# EAGLE design LEDscape (EAGLE 6.5.0)
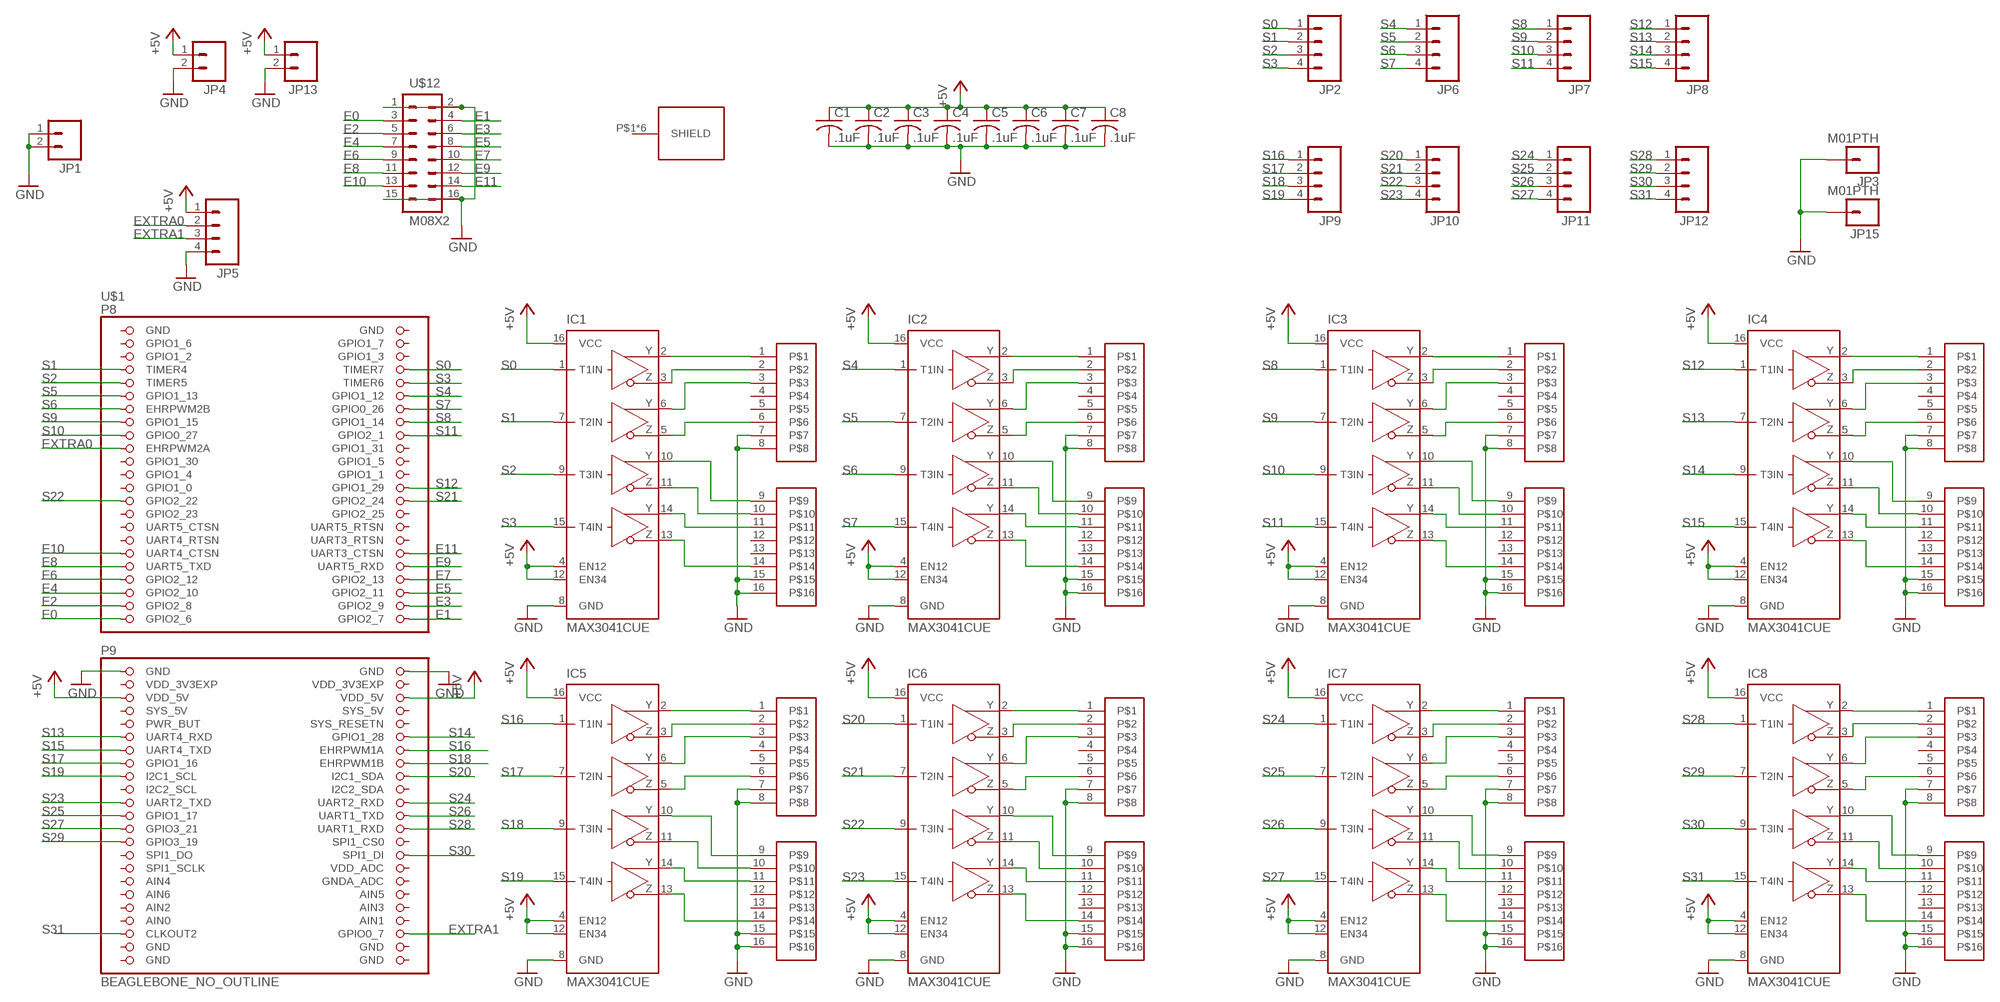
[diagram p0: schematic, sheet 1]

## Parts
C1  .1uF  C-USC0603  [C0603]
C2  .1uF  C-USC0603  [C0603]
C3  .1uF  C-USC0603  [C0603]
C4  .1uF  C-USC0603  [C0603]
C5  .1uF  C-USC0603  [C0603]
C6  .1uF  C-USC0603  [C0603]
C7  .1uF  C-USC0603  [C0603]
C8  .1uF  C-USC0603  [C0603]
IC1  MAX3041CUE  [TSSOP16]
IC2  MAX3041CUE  [TSSOP16]
IC3  MAX3041CUE  [TSSOP16]
IC4  MAX3041CUE  [TSSOP16]
IC5  MAX3041CUE  [TSSOP16]
IC6  MAX3041CUE  [TSSOP16]
IC7  MAX3041CUE  [TSSOP16]
IC8  MAX3041CUE  [TSSOP16]
JP1  M025MM  [SCREWTERMINAL-5MM-2]
JP2  M041X04_NO_SILK  [1X04_NO_SILK]
JP3  M01PTH  [1X01]
JP4  M025MM  [SCREWTERMINAL-5MM-2]
JP5  M041X04_NO_SILK  [1X04_NO_SILK]
JP6  M041X04_NO_SILK  [1X04_NO_SILK]
JP7  M041X04_NO_SILK  [1X04_NO_SILK]
JP8  M041X04_NO_SILK  [1X04_NO_SILK]
JP9  M041X04_NO_SILK  [1X04_NO_SILK]
JP10  M041X04_NO_SILK  [1X04_NO_SILK]
JP11  M041X04_NO_SILK  [1X04_NO_SILK]
JP12  M041X04_NO_SILK  [1X04_NO_SILK]
JP13  M025MM  [SCREWTERMINAL-5MM-2]
JP15  M01PTH  [1X01]
U$1  BEAGLEBONE_NO_OUTLINE  [BEAGLEBONE_SHIELD_NO_OUTLINE]
U$2  RJ45_8X2_BASE  [RJ45_8X2_BASE]
U$3  RJ45_8X2_JACK  [RJ45_8X2_JACK]
U$4  RJ45_8X2_JACK  [RJ45_8X2_JACK]
U$5  RJ45_8X2_JACK  [RJ45_8X2_JACK]
U$6  RJ45_8X2_JACK  [RJ45_8X2_JACK]
U$7  RJ45_8X2_JACK  [RJ45_8X2_JACK]
U$8  RJ45_8X2_JACK  [RJ45_8X2_JACK]
U$9  RJ45_8X2_JACK  [RJ45_8X2_JACK]
U$10  RJ45_8X2_JACK  [RJ45_8X2_JACK]
U$12  M08X2  [2X8]

## Nets
+5V: C1.1 C2.1 C3.1 C4.1 C5.1 C6.1 C7.1 C8.1 IC1.4(EN12) IC1.12(EN34) IC1.16(VCC) IC2.4(EN12) IC2.12(EN34) IC2.16(VCC) IC3.4(EN12) IC3.12(EN34) IC3.16(VCC) IC4.4(EN12) IC4.12(EN34) IC4.16(VCC) IC5.4(EN12) IC5.12(EN34) IC5.16(VCC) IC6.4(EN12) IC6.12(EN34) IC6.16(VCC) IC7.4(EN12) IC7.12(EN34) IC7.16(VCC) IC8.4(EN12) IC8.12(EN34) IC8.16(VCC) JP4.1 JP5.1 JP13.1 U$1.51(VDD_5V) U$1.52(VDD_5V)
E0: U$1.45(GPIO2_6) U$12.3
E1: U$1.46(GPIO2_7) U$12.4
E2: U$1.43(GPIO2_8) U$12.5
E3: U$1.44(GPIO2_9) U$12.6
E4: U$1.41(GPIO2_10) U$12.7
E5: U$1.42(GPIO2_11) U$12.8
E6: U$1.39(GPIO2_12) U$12.9
E7: U$1.40(GPIO2_13) U$12.10
E8: U$1.37(UART5_TXD) U$12.11
E9: U$1.38(UART5_RXD) U$12.12
E10: U$1.35(UART4_CTSN) U$12.13
E11: U$1.36(UART3_CTSN) U$12.14
EXTRA0: JP5.2 U$1.19(EHRPWM2A)
EXTRA1: JP5.3 U$1.88(GPIO0_7)
GND: C1.2 C2.2 C3.2 C4.2 C5.2 C6.2 C7.2 C8.2 IC1.8(GND) IC2.8(GND) IC3.8(GND) IC4.8(GND) IC5.8(GND) IC6.8(GND) IC7.8(GND) IC8.8(GND) JP1.1 JP1.2 JP3.1 JP4.2 JP5.4 JP13.2 JP15.1 U$1.47(GND) U$1.48(GND) U$3.7 U$3.8 U$3.15 U$3.16 U$4.7 U$4.8 U$4.15 U$4.16 U$5.7 U$5.8 U$5.15 U$5.16 U$6.7 U$6.8 U$6.15 U$6.16 U$7.7 U$7.8 U$7.15 U$7.16 U$8.7 U$8.8 U$8.15 U$8.16 U$9.7 U$9.8 U$9.15 U$9.16 U$10.7 U$10.8 U$10.15 U$10.16 U$12.1 U$12.2 U$12.15 U$12.16
N$1: IC1.2(Y1) U$3.1
N$2: IC1.3(Z1) U$3.2
N$3: IC2.2(Y1) U$4.1
N$4: IC1.6(Y2) U$3.3
N$5: IC1.5(Z2) U$3.6
N$6: IC1.10(Y3) U$3.9
N$7: IC1.11(Z3) U$3.10
N$8: IC1.14(Y4) U$3.11
N$9: IC1.13(Z4) U$3.14
N$10: IC2.3(Z1) U$4.2
N$11: IC6.5(Z2) U$7.6
N$12: IC2.6(Y2) U$4.3
N$13: IC2.5(Z2) U$4.6
N$14: IC3.5(Z2) U$5.6
N$15: IC2.10(Y3) U$4.9
N$16: IC2.11(Z3) U$4.10
N$17: IC2.14(Y4) U$4.11
N$18: IC2.13(Z4) U$4.14
N$19: IC3.2(Y1) U$5.1
N$20: IC3.3(Z1) U$5.2
N$21: IC3.6(Y2) U$5.3
N$22: IC3.13(Z4) U$5.14
N$23: IC3.10(Y3) U$5.9
N$24: IC3.11(Z3) U$5.10
N$25: IC3.14(Y4) U$5.11
N$26: IC7.6(Y2) U$8.3
N$27: IC4.2(Y1) U$9.1
N$28: IC4.3(Z1) U$9.2
N$29: IC4.6(Y2) U$9.3
N$30: IC4.5(Z2) U$9.6
N$31: IC4.13(Z4) U$9.14
N$32: IC4.11(Z3) U$9.10
N$33: IC4.14(Y4) U$9.11
N$34: IC4.10(Y3) U$9.9
N$35: IC5.2(Y1) U$6.1
N$36: IC5.3(Z1) U$6.2
N$37: IC5.6(Y2) U$6.3
N$38: IC5.5(Z2) U$6.6
N$39: IC5.10(Y3) U$6.9
N$40: IC5.11(Z3) U$6.10
N$41: IC5.14(Y4) U$6.11
N$42: IC5.13(Z4) U$6.14
N$43: IC6.2(Y1) U$7.1
N$44: IC6.3(Z1) U$7.2
N$45: IC6.6(Y2) U$7.3
N$46: IC7.5(Z2) U$8.6
N$47: IC6.10(Y3) U$7.9
N$48: IC6.11(Z3) U$7.10
N$49: IC6.14(Y4) U$7.11
N$50: IC6.13(Z4) U$7.14
N$51: IC7.2(Y1) U$8.1
N$52: IC7.3(Z1) U$8.2
N$53: IC7.10(Y3) U$8.9
N$54: IC7.14(Y4) U$8.11
N$55: IC7.13(Z4) U$8.14
N$56: IC7.11(Z3) U$8.10
N$58: IC8.6(Y2) U$10.3
N$59: IC8.2(Y1) U$10.1
N$60: IC8.3(Z1) U$10.2
N$61: IC8.5(Z2) U$10.6
N$62: IC8.14(Y4) U$10.11
N$63: IC8.10(Y3) U$10.9
N$64: IC8.11(Z3) U$10.10
N$65: IC8.13(Z4) U$10.14
S0: IC1.1(T1IN) JP2.1 U$1.8(TIMER7)
S1: IC1.7(T2IN) JP2.2 U$1.7(TIMER4)
S2: IC1.9(T3IN) JP2.3 U$1.9(TIMER5)
S3: IC1.15(T4IN) JP2.4 U$1.10(TIMER6)
S4: IC2.1(T1IN) JP6.1 U$1.12(GPIO1_12)
S5: IC2.7(T2IN) JP6.2 U$1.11(GPIO1_13)
S6: IC2.9(T3IN) JP6.3 U$1.13(EHRPWM2B)
S7: IC2.15(T4IN) JP6.4 U$1.14(GPIO0_26)
S8: IC3.1(T1IN) JP7.1 U$1.16(GPIO1_14)
S9: IC3.7(T2IN) JP7.2 U$1.15(GPIO1_15)
S10: IC3.9(T3IN) JP7.3 U$1.17(GPIO0_27)
S11: IC3.15(T4IN) JP7.4 U$1.18(GPIO2_1)
S12: IC4.1(T1IN) JP8.1 U$1.26(GPIO1_29)
S13: IC4.7(T2IN) JP8.2 U$1.57(UART4_RXD)
S14: IC4.9(T3IN) JP8.3 U$1.58(GPIO1_28)
S15: IC4.15(T4IN) JP8.4 U$1.59(UART4_TXD)
S16: IC5.1(T1IN) JP9.1 U$1.60(EHRPWM1A)
S17: IC5.7(T2IN) JP9.2 U$1.61(GPIO1_16)
S18: IC5.9(T3IN) JP9.3 U$1.62(EHRPWM1B)
S19: IC5.15(T4IN) JP9.4 U$1.63(I2C1_SCL)
S20: IC6.1(T1IN) JP10.1 U$1.64(I2C1_SDA)
S21: IC6.7(T2IN) JP10.2 U$1.28(GPIO2_24)
S22: IC6.9(T3IN) JP10.3 U$1.27(GPIO2_22)
S23: IC6.15(T4IN) JP10.4 U$1.67(UART2_TXD)
S24: IC7.1(T1IN) JP11.1 U$1.68(UART2_RXD)
S25: IC7.7(T2IN) JP11.2 U$1.69(GPIO1_17)
S26: IC7.9(T3IN) JP11.3 U$1.70(UART1_TXD)
S27: IC7.15(T4IN) JP11.4 U$1.71(GPIO3_21)
S28: IC8.1(T1IN) JP12.1 U$1.72(UART1_RXD)
S29: IC8.7(T2IN) JP12.2 U$1.73(GPIO3_19)
S30: IC8.9(T3IN) JP12.3 U$1.76(SPI1_DI)
S31: IC8.15(T4IN) JP12.4 U$1.87(CLKOUT2)
Unconnected: U$1.3(GPIO1_6) U$1.4(GPIO1_7) U$1.5(GPIO1_2) U$1.6(GPIO1_3) U$1.20(GPIO1_31) U$1.21(GPIO1_30) U$1.22(GPIO1_5) U$1.23(GPIO1_4) U$1.24(GPIO1_1) U$1.25(GPIO1_0) U$1.29(GPIO2_23) U$1.30(GPIO2_25) U$1.31(UART5_CTSN) U$1.32(UART5_RTSN) U$1.33(UART4_RTSN) U$1.34(UART3_RTSN) U$1.54(SYS_5V) U$1.55(PWR_BUT) U$1.56(SYS_RESETN) U$1.65(I2C2_SCL) U$1.66(I2C2_SDA) U$1.74(SPI1_CS0) U$1.75(SPI1_DO) U$1.77(SPI1_SCLK) U$1.78(VDD_ADC) U$1.79(AIN4) U$1.80(GNDA_ADC) U$1.81(AIN6) U$1.82(AIN5) U$1.83(AIN2) U$1.84(AIN3) U$1.86(AIN1) U$2.P$1(SHIELD) U$2.P$2(SHIELD) U$2.P$3(SHIELD) U$2.P$4(SHIELD) U$2.P$5(SHIELD) U$2.P$6(SHIELD) U$3.4 U$3.5 U$3.12 U$3.13 U$4.4 U$4.5 U$4.12 U$4.13 U$5.4 U$5.5 U$5.12 U$5.13 U$6.4 U$6.5 U$6.12 U$6.13 U$7.4 U$7.5 U$7.12 U$7.13 U$8.4 U$8.5 U$8.12 U$8.13 U$9.4 U$9.5 U$9.12 U$9.13 U$10.4 U$10.5 U$10.12 U$10.13

## Power pins joined to a net without a drawn wire
AIN0: U$1.85(AIN0)
GND: U$1.1(GND) U$1.2(GND) U$1.89(GND) U$1.90(GND) U$1.91(GND) U$1.92(GND)
SYS_5V: U$1.53(SYS_5V)
VDD_3V3EXP: U$1.49(VDD_3V3EXP) U$1.50(VDD_3V3EXP)

## Library data of the parts
C1-C8 = adafruit:C-US: CAPACITOR, American symbol
IC1-IC8 = maxim:MAX30*: ±10kV ESD-Protected, Quad 5V RS-485/RS-422 Transmitters Source: www.maxim-ic.com .. MAX3040-MAX3045.pdf; MPN: MAX3041CUE+; OC_FARNELL: unknown; OC_NEWARK: 73K8525
JP1 JP4 JP13 = SparkFun-Connectors:M02: Header 2 Standard 2-pin 0.1" header. Use with straight break away headers (SKU : PRT-00116), right angle break away headers (PRT-00553), swiss pins (PRT-00743), machine pins (PRT-00117), and female headers (PRT-00115). Molex polarized connector foot print use with SKU : PRT-08233 with associated crimp pins and housings.
JP2 JP5-JP12 = SparkFun-Connectors:M04: Header 4 Standard 4-pin 0.1" header. Use with straight break away headers (SKU : PRT-00116), right angle break away headers (PRT-00553), swiss pins (PRT-00743), machine pins (PRT-00117), and female headers (PRT-00115). Molex polarized connector foot print use with SKU : PRT-08231 with associated crimp pins and housings. 1MM SMD Version SKU: PRT-10208
JP3 JP15 = SparkFun-Connectors:M01: Header 1 Standard 1-pin 0.1" header. Use with straight break away headers (SKU : PRT-00116), right angle break away headers (PRT-00553), swiss pins (PRT-00743), machine pins (PRT-00117), and female headers (PRT-00115).
U$1 = LEDscape:BEAGLEBONE_NO_OUTLINE: Should match A3 pinout - but not completely tested
U$2 = LEDscape:RJ45_8X2_BASE
U$3-U$10 = LEDscape:RJ45_8X2_JACK
U$12 = SparkFun-Connectors:M08X2: .1" headers, two rows of 8 each

## Board
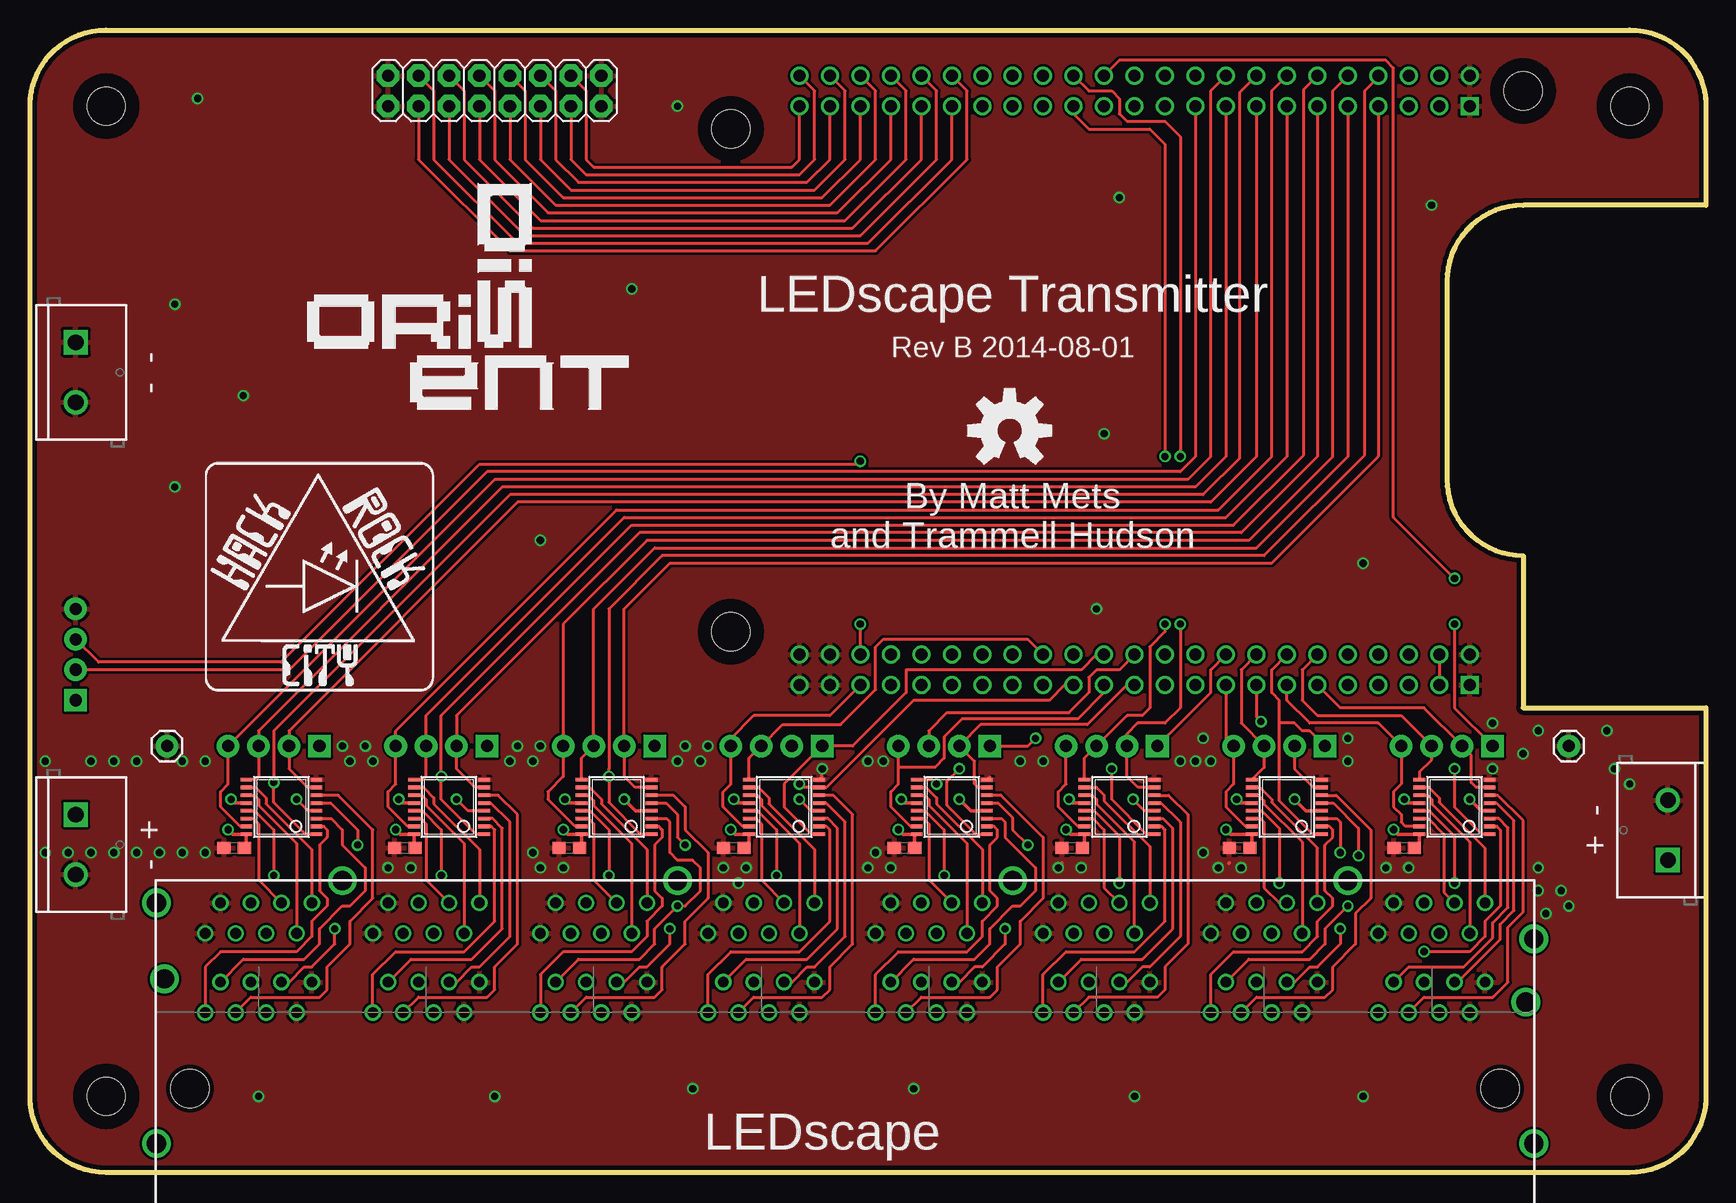
[diagram p1: board, top side]
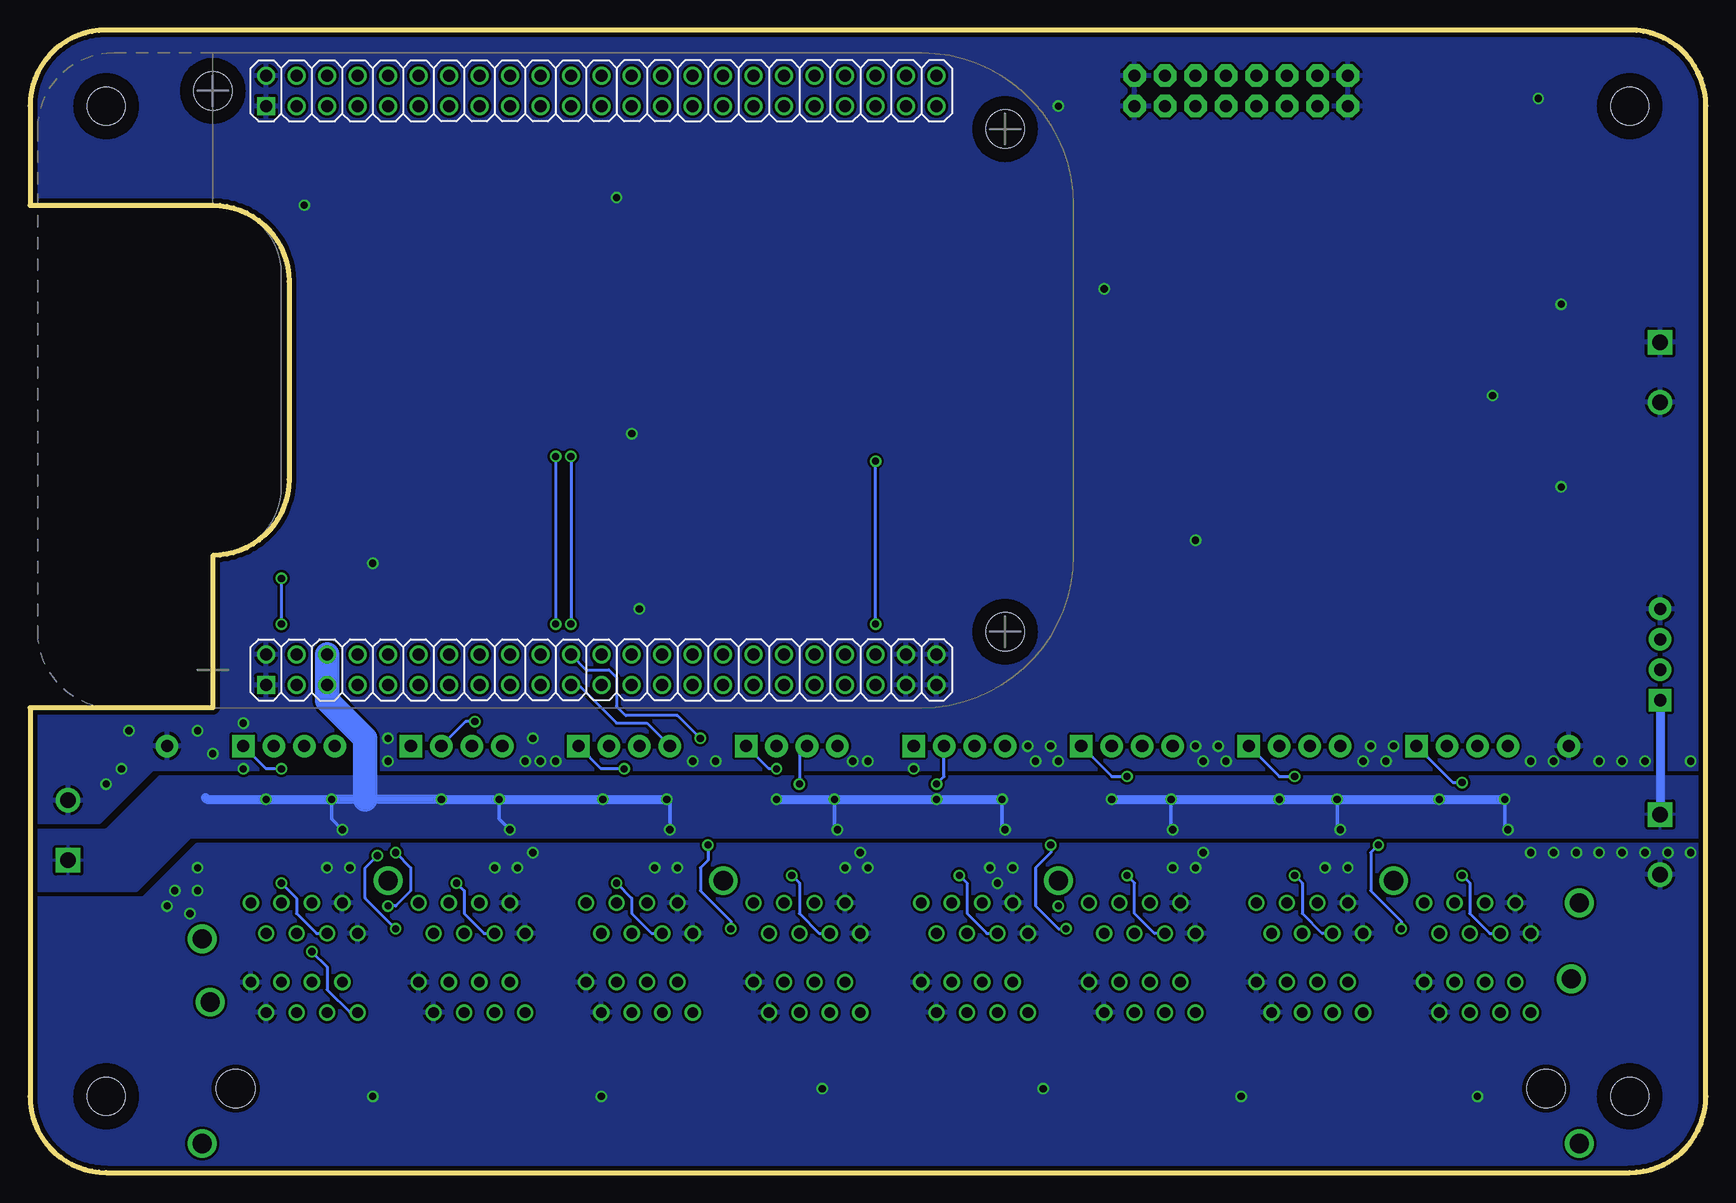
[diagram p2: board, bottom side, seen from below]

Size 139.7 x 95.25 mm. Coordinates in mm from the lower left corner, seen from the top.
Outline: 139.7,38.73 139.7,6.35 arc-90 133.35,0 6.35,0 arc-90 0,6.35 0,88.9 arc-90 6.35,95.25 133.35,95.25 arc-90 139.7,88.9 139.7,80.64 124.46,80.64 arc90 118.11,74.3 118.11,57.78 arc90 124.46,51.44 124.46,38.73 139.7,38.73
Copper layers (1+16): Top 0.0356mm / dielectric 1.5011mm / Bottom 0.0356mm
Design rules "LaenPCBOrder *": minimum track width 10mil, minimum drill 13mil, track to track 8mil, track to pad 8mil, pad to pad 8mil, via to via 8mil, smd to smd 6mil, copper to edge 15mil, drill to drill 6mil, minimum pad ring 7mil, minimum via ring 7mil, stop-mask expansion 4mil, vias tented up to drill 2mm, thermal gap 10mil
Holes 3.17 mm at 133.35,6.35 6.35,6.35 133.35,88.9 6.35,88.9 124.46,90.17 58.42,45.09 58.42,87
tRestrict: area 130.8,3.8 to 135.9,8.9; area 3.8,3.8 to 8.9,8.9; area 130.8,86.4 to 135.9,91.4; area 3.8,86.4 to 8.9,91.4; area 121.9,87.6 to 127,92.7; area 55.9,42.5 to 61,47.6; area 55.9,84.5 to 61,89.5
bRestrict: area 130.8,3.8 to 135.9,8.9; area 3.8,3.8 to 8.9,8.9; area 130.8,86.4 to 135.9,91.4; area 3.8,86.4 to 8.9,91.4; area 121.9,87.6 to 127,92.7; area 55.9,42.5 to 61,47.6; area 55.9,84.5 to 61,89.5

### Footprints (pad centres in the part's own frame; a part is rotated, then mirrored left to right if it is on the bottom)
C0603 = smd 1.1 x 1: 1 -0.85,0; 2 0.85,0
TSSOP16 = smd 0.305 x 0.991: 1 -2.275,-2.918; 2 -1.625,-2.918; 3 -0.975,-2.918; 4 -0.325,-2.918; 5 0.325,-2.918; 6 0.975,-2.918; 7 1.625,-2.918; 8 2.275,-2.918; 9 2.275,2.918; 10 1.625,2.918; 11 0.975,2.918; 12 0.325,2.918; 13 -0.325,2.918; 14 -0.975,2.918; 15 -1.625,2.918; 16 -2.275,2.918
SCREWTERMINAL-5MM-2 = drill 1.3 pad 2.032 square: 1 0,0 | drill 1.3 pad 2.032: 2 5,0
1X04_NO_SILK = drill 1.016 pad 1.88 square: 1 0,0 | drill 1.016 pad 1.88: 2 2.54,0; 3 5.08,0; 4 7.62,0
1X01 = drill 1.016 pad 1.88: 1 0,0
BEAGLEBONE_SHIELD_NO_OUTLINE = drill 1 square: 1 4.445,19.05; 47 52.705,19.05 | drill 1: 2 1.905,19.05; 3 4.445,21.59; 4 1.905,21.59; 5 4.445,24.13; 6 1.905,24.13; 7 4.445,26.67; 8 1.905,26.67; 9 4.445,29.21; 10 1.905,29.21; 11 4.445,31.75; 12 1.905,31.75; 13 4.445,34.29; 14 1.905,34.29; 15 4.445,36.83; 16 1.905,36.83; 17 4.445,39.37; 18 1.905,39.37; 19 4.445,41.91; 20 1.905,41.91; 21 4.445,44.45; 22 1.905,44.45; 23 4.445,46.99; 24 1.905,46.99; 25 4.445,49.53; 26 1.905,49.53; 27 4.445,52.07; 28 1.905,52.07; 29 4.445,54.61; 30 1.905,54.61; 31 4.445,57.15; 32 1.905,57.15; 33 4.445,59.69; 34 1.905,59.69; 35 4.445,62.23; 36 1.905,62.23; 37 4.445,64.77; 38 1.905,64.77; 39 4.445,67.31; 40 1.905,67.31; 41 4.445,69.85; 42 1.905,69.85; 43 4.445,72.39; 44 1.905,72.39; 45 4.445,74.93; 46 1.905,74.93; 48 50.165,19.05; 49 52.705,21.59; 50 50.165,21.59; 51 52.705,24.13; 52 50.165,24.13; 53 52.705,26.67; 54 50.165,26.67; 55 52.705,29.21; 56 50.165,29.21; 57 52.705,31.75; 58 50.165,31.75; 59 52.705,34.29; 60 50.165,34.29; 61 52.705,36.83; 62 50.165,36.83; 63 52.705,39.37; 64 50.165,39.37; 65 52.705,41.91; 66 50.165,41.91; 67 52.705,44.45; 68 50.165,44.45; 69 52.705,46.99; 70 50.165,46.99; 71 52.705,49.53; 72 50.165,49.53; 73 52.705,52.07; 74 50.165,52.07; 75 52.705,54.61; 76 50.165,54.61; 77 52.705,57.15; 78 50.165,57.15; 79 52.705,59.69; 80 50.165,59.69; 81 52.705,62.23; 82 50.165,62.23; 83 52.705,64.77; 84 50.165,64.77; 85 52.705,67.31; 86 50.165,67.31; 87 52.705,69.85; 88 50.165,69.85; 89 52.705,72.39; 90 50.165,72.39; 91 52.705,74.93; 92 50.165,74.93
RJ45_8X2_BASE = drill 1.6: P$1 -57.4,15.5; P$2 -56.73,9.15; P$3 -57.4,-4.57; P$4 57.4,12.5; P$5 56.73,7.22; P$6 57.4,-4.57; P$7 13.97,17.35; P$8 41.91,17.35; P$9 -41.91,17.35; P$10 -13.97,17.35 | hole 3.2: -54.61,0; 54.61,0
RJ45_8X2_JACK = drill 0.9: 1 -4.445,0; 2 -3.175,2.54; 3 -1.905,0; 4 -0.635,2.54; 5 0.635,0; 6 1.905,2.54; 7 3.175,0; 8 4.445,2.54; 9 4.445,9.14; 10 3.175,6.6; 11 1.905,9.14; 12 0.635,6.6; 13 -0.635,9.14; 14 -1.905,6.6; 15 -3.175,9.14; 16 -4.445,6.6
2X8 = drill 1.016 pad 1.88 octagon: 1 0,0; 2 0,2.54; 3 2.54,0; 4 2.54,2.54; 5 5.08,0; 6 5.08,2.54; 7 7.62,0; 8 7.62,2.54; 9 10.16,0; 10 10.16,2.54; 11 12.7,0; 12 12.7,2.54; 13 15.24,0; 14 15.24,2.54; 15 17.78,0; 16 17.78,2.54

### Placement (x,y rotation side)
C1  17.02,27.05 180 top
C2  31.24,27.05 180 top
C3  44.96,27.05 180 top
C4  58.67,27.05 180 top
C5  72.9,27.05 180 top
C6  86.87,27.05 180 top
C7  100.84,27.05 180 top
C8  114.55,27.05 180 top
IC1  48.9,30.48 90 top
IC2  34.92,30.48 90 top
IC3  20.95,30.48 90 top
IC4  118.75,30.48 90 top
IC5  104.78,30.48 90 top
IC6  90.81,30.48 90 top
IC7  76.83,30.48 90 top
IC8  62.87,30.48 90 top
JP1  3.81,69.22 270 top
JP2  52.07,35.56 180 top
JP3  11.43,35.56 0 top
JP4  3.81,29.84 270 top
JP5  3.81,39.37 90 top
JP6  38.1,35.56 180 top
JP7  24.13,35.56 180 top
JP8  121.92,35.56 180 top
JP9  107.95,35.56 180 top
JP10  93.98,35.56 180 top
JP11  80.01,35.56 180 top
JP12  66.04,35.56 180 top
JP13  136.53,26.04 90 top
JP15  128.27,35.56 0 top
U$1  139.06,93.34 270 bottom
U$2  67.94,6.99 0 top
U$3  46.99,13.34 0 top
U$4  33.02,13.34 0 top
U$5  19.05,13.34 0 top
U$6  102.87,13.34 0 top
U$7  88.9,13.34 0 top
U$8  74.93,13.34 0 top
U$9  116.84,13.34 0 top
U$10  60.96,13.34 0 top
U$11  [OSHW-LOGO-L]  81.66,61.85 0 top
U$12  47.62,91.44 180 top
U$13  [HRC_LOGO_0.75IN]  14.61,40.13 0 top
U$14  [DISORIENT_LOGO]  36.96,71.12 270 top

### Tracks (layer width: path | path; a pad name or v marks a point on that pad's centre or on a via)
+5V  (via drill 0.6)
  Top 0.254: IC8.4 65.09,30.16 v64.14,31.11 | IC2.4 36.52,30.16 v35.56,31.11 | IC6.4 92.91,30.16 v91.95,31.11 | IC3.4 23.18,30.16 v22.23,31.11
  Top 0.305: C5.1 73.75,28.04 IC7.16 72.76,28.2 v72.39,28.57 | C4.1 59.95,27.47 IC8.16 58.79,28.2 v58.42,28.57 | C3.1 45.98,27.22 IC1.16 44.82,28.2 v44.45,28.57 | C2.1 32.01,27.14 IC2.16 30.85,28.2 v30.48,28.57 | C1.1 18.04,27.22 IC3.16 16.88,28.2 v16.51,28.57 | C6.1 87.89,27.22 IC6.16 86.73,28.2 v86.36,28.57 | C7.1 101.86,27.22 IC5.16 100.06,28.2 v99.69,28.57 | C8.1 115.83,27.47 IC4.16 114.03,28.2 v113.67,28.57 | v16.76,31.11 17.07,30.8 IC3.12 | IC2.12 31.04,30.8 v30.73,31.11 | IC1.12 44.89,30.8 v44.58,31.11 | IC1.4 50.49,30.16 v49.53,31.11 | IC8.12 58.98,30.8 v58.67,31.11 | IC7.4 78.43,30.16 v77.47,31.11 | IC7.12 72.95,30.8 v72.64,31.11 | IC5.4 106.37,30.16 v105.41,31.11 | v86.61,31.11 86.92,30.8 IC6.12 | IC5.12 100.89,30.8 v100.58,31.11 | IC4.12 114.86,30.8 v114.55,31.11 | IC4.4 120.97,30.16 v120.02,31.11
  Bottom 0.305: v16.51,28.57 16.51,28.7 16.76,28.96 v16.76,31.11 | v30.73,31.11 30.73,28.96 30.48,28.7 v30.48,28.57 | v44.45,28.57 44.58,28.7 v44.58,31.11 | v58.42,28.57 58.67,28.83 v58.67,31.11 | v72.64,31.11 72.64,28.83 v72.39,28.57 | v86.61,31.11 86.36,30.86 v86.36,28.57 | v99.69,28.57 100.58,29.46 v100.58,31.11 | v114.55,31.11 114.55,29.46 v113.67,28.57
  Bottom 0.762: v16.76,31.11 v22.23,31.11 v30.73,31.11 v35.56,31.11 v44.58,31.11 v49.53,31.11 | v58.67,31.11 v64.14,31.11 v72.64,31.11 v77.47,31.11 | v86.61,31.11 v91.95,31.11 v100.58,31.11 v105.41,31.11 111.76,31.11 v114.55,31.11 v120.02,31.11 124.97,31.11 125.09,31.24 | JP5.1 JP4.1
  Bottom 2.032: 111.76,31.11 111.76,36.2 114.94,39.37 U$1.51 U$1.52
  pour Bottom: 128.91,33.02 0,33.02 0,27.94 126.36,27.94 130.81,23.5 139.7,23.5 139.7,28.57 133.35,28.57
E0
  Top 0.254: U$12.3 46.35,90.17 46.35,84.45 46.99,83.82 63.5,83.82 64.14,84.45 U$1.45
E1
  Top 0.254: U$12.4 45.09,84.45 46.35,83.19 64.14,83.19 65.41,84.45 65.41,90.17 U$1.46
E2
  Top 0.254: U$12.5 43.81,90.17 43.81,84.45 45.72,82.55 64.77,82.55 66.67,84.45 U$1.43
E3
  Top 0.254: U$12.6 42.55,84.45 45.09,81.92 65.41,81.92 67.94,84.45 67.94,90.17 U$1.44
E4
  Top 0.254: U$12.7 41.27,90.17 41.27,84.45 44.45,81.28 66.04,81.28 69.22,84.45 U$1.41
E5
  Top 0.254: U$12.8 40.01,84.45 43.81,80.64 66.67,80.64 70.48,84.45 70.48,90.17 U$1.42
E6
  Top 0.254: U$12.9 38.73,90.17 38.73,84.45 43.18,80.01 67.31,80.01 71.75,84.45 U$1.39
E7
  Top 0.254: U$12.10 37.47,84.45 42.55,79.38 67.94,79.38 73.03,84.45 73.03,90.17 U$1.40
E8
  Top 0.254: U$12.11 36.2,90.17 36.2,84.45 41.91,78.74 68.58,78.74 74.3,84.45 U$1.37
E9
  Top 0.254: U$12.12 34.92,84.45 41.27,78.11 69.22,78.11 75.56,84.45 75.56,90.17 U$1.38
E10
  Top 0.254: U$12.13 33.66,90.17 33.66,84.45 40.64,77.47 69.85,77.47 76.83,84.45 U$1.35
E11
  Top 0.254: U$12.14 32.38,84.45 40.01,76.83 70.48,76.83 78.11,84.45 78.11,90.17 U$1.36
EXTRA0
  Top 0.254: U$1.19 97.16,59.69 95.89,58.42 38.1,58.42 21.59,41.91 JP5.2
EXTRA1  (via drill 0.6)
  Top 0.254: U$1.88 v69.22,45.72 | JP5.3 5.71,42.55 20.95,42.55 37.47,59.05 68.96,59.05 v69.22,59.31
  Bottom 0.254: v69.22,45.72 v69.22,59.31
GND  (via drill 0.6)
  Top 0.254: IC8.8 66.04,33.01 v66.04,33.66 | IC7.8 80.01,33.01
  Top 0.305: 85.98,25.78 86.02,25.82 | 99.95,25.78 99.99,25.82
  other vias: 42.55,25.4 40.01,34.29 26.67,34.29 31.75,25.4 53.98,34.29 57.78,25.4 69.85,34.29 69.85,25.4 73.66,6.99 55.24,6.99 38.73,6.35 19.05,6.35 92.08,6.35 111.12,6.35 84.45,34.29 85.72,25.4 95.89,34.29 97.79,26.67 113.03,25.4 12.06,72.39 17.78,64.77 12.06,57.15 42.55,52.7 53.98,88.9 50.16,73.66 90.81,81.28 89.53,61.59 116.84,80.64 111.12,50.8 88.9,46.99 13.97,89.53 121.92,33.66 55.88,34.29 70.48,26.67 41.91,34.29 41.91,26.67 29.84,25.4 28.57,34.29 14.61,34.29 8.89,34.29 6.99,34.29 6.99,26.67 8.89,26.67 10.79,26.67 12.7,26.67 14.61,26.67 12.7,34.29 5.08,34.29 5.08,26.67 3.17,26.67 1.27,26.67 1.27,34.29 59.69,25.4 44.45,25.4 82.55,34.29 87.63,25.4 71.12,34.29 97.16,34.29 99.06,25.4 100.97,25.4 114.94,25.4 98.42,34.29 97.79,36.2 121.92,37.47 124.46,34.92 125.73,36.83 125.73,25.4 127.64,23.5 125.73,23.5 126.36,21.59 128.27,22.23 132.08,33.66 133.35,32.38 131.44,36.83 109.86,34.29 109.86,36.2 26.04,35.56 27.94,35.56 40.64,35.56 42.55,35.56 56.52,35.56 54.61,35.56 71.75,25.4 59.05,24.13
  pour Bottom: 0,33.66 129.54,33.66 133.99,29.21 139.7,29.21 139.7,95.25 0,95.25
  pour Top: 0,0 139.7,0 139.7,95.25 0,95.25
  pour Bottom: 0,0 139.7,0 139.7,22.86 130.18,22.86 125.73,27.3 0,27.3
N$1
  Top 0.254: IC1.2 52.42,28.86 52.7,28.57 52.7,27.94 52.07,27.3 52.07,23.5 52.7,22.86 52.7,22.23 51.44,20.95 51.44,19.68 50.16,18.41 44.45,18.41 42.55,16.51 U$3.1
N$2  (via drill 0.6)
  Top 0.254: U$3.2 45.72,17.78 50.8,17.78 52.07,19.05 52.07,20.32 v53.98,22.23 54.61,22.23 55.88,23.5 55.88,25.4 55.24,26.04 53.98,26.04 53.34,26.67 53.34,29.21 53.05,29.5 IC1.3
N$3
  Top 0.254: U$4.1 28.57,16.51 30.48,18.41 36.2,18.41 38.73,20.95 38.73,28.57 38.45,28.86 IC2.2
N$4
  Top 0.254: U$3.3 46.35,14.61 52.07,14.61 52.7,15.24 52.7,17.14 54.61,19.05 54.61,20.95 56.52,22.86 56.52,26.67 54.61,28.57 54.61,30.48 53.63,31.45 IC1.6
N$5  (via drill 0.6)
  Top 0.254: U$3.6 49.53,15.88 50.8,17.14 51.44,17.14 53.34,19.05 v53.34,20.32 | IC1.5 53.02,30.8 53.98,29.84 53.98,27.94 v54.61,27.3
  Bottom 0.254: v54.61,27.3 54.61,26.67 55.88,25.4 55.88,22.23 53.98,20.32 v53.34,20.32
N$6
  Top 0.254: IC1.10 46.63,32.1 47.62,31.11 47.62,30.73 51.44,26.92 U$3.9
N$7
  Top 0.254: IC1.11 46.52,31.45 46.99,30.99 46.99,30.61 50.16,27.43 U$3.10
N$8
  Top 0.254: IC1.14 46.57,29.5 46.99,29.08 46.99,24.38 U$3.11
N$9  (via drill 0.6)
  Top 0.254: IC1.13 46.68,30.16 48.26,28.57 v48.26,24.77
  Bottom 0.254: v48.26,24.77 47.62,24.13 47.62,21.59 45.97,19.93 U$3.14
N$10
  Top 0.254: U$4.2 31.75,17.78 36.83,17.78 39.37,20.32 39.37,28.7 38.57,29.5 IC2.3
N$11
  Top 0.254: U$7.6 91.44,15.88 92.71,17.14 93.34,17.14 95.89,19.68 95.89,29.21 94.29,30.8 IC6.5
N$12
  Top 0.254: U$4.3 32.38,14.61 38.1,14.61 38.73,15.24 38.73,17.14 40.64,19.05 40.64,29.84 39.03,31.45 IC2.6
N$13
  Top 0.254: U$4.6 35.56,15.88 36.83,17.14 37.47,17.14 40.01,19.68 40.01,29.21 38.41,30.8 IC2.5
N$14  (via drill 0.6)
  Top 0.254: U$5.6 21.59,15.88 22.86,17.14 23.5,17.14 25.4,19.05 v25.4,20.32 | IC3.5 25.07,30.8 27.3,28.57 v27.3,27.3
  Bottom 0.254: v27.3,27.3 27.94,26.67 27.94,23.5 25.4,20.95 v25.4,20.32
N$15
  Top 0.254: IC2.10 32.79,32.1 33.66,31.24 33.66,30.73 37.47,26.92 U$4.9
N$16
  Top 0.254: IC2.11 32.68,31.45 33.02,31.11 33.02,30.61 36.2,27.43 U$4.10
N$17
  Top 0.254: IC2.14 32.6,29.5 33.02,29.08 33.02,24.38 U$4.11
N$18  (via drill 0.6)
  Top 0.254: IC2.13 32.71,30.16 34.29,28.57 v34.29,24.77
  Bottom 0.254: v34.29,24.77 33.66,24.13 33.66,21.59 32,19.93 U$4.14
N$19
  Top 0.254: IC3.2 24.48,28.86 24.77,28.57 24.77,27.94 24.13,27.3 24.13,23.5 24.77,22.86 24.77,22.23 23.5,20.95 23.5,19.68 22.23,18.41 15.88,18.41 14.61,17.14 U$5.1
N$20
  Top 0.254: U$5.2 17.78,17.78 22.86,17.78 24.13,19.05 24.13,20.32 26.04,22.23 26.67,22.23 27.94,23.5 27.94,25.4 26.04,27.3 26.04,28.57 25.11,29.5 IC3.3
N$21
  Top 0.254: U$5.3 18.41,14.61 24.13,14.61 24.77,15.24 24.77,17.14 26.67,19.05 26.67,20.95 28.57,22.86 28.57,28.57 25.7,31.45 IC3.6
N$22  (via drill 0.6)
  Top 0.254: IC3.13 18.74,30.16 20.32,28.57 v20.32,24.77
  Bottom 0.254: v20.32,24.77 19.68,24.13 19.68,21.59 18.03,19.93 U$5.14
N$23
  Top 0.254: IC3.10 18.82,32.1 19.68,31.24 19.68,30.73 23.5,26.92 U$5.9
N$24
  Top 0.254: IC3.11 18.71,31.45 19.05,31.11 19.05,30.61 22.23,27.43 U$5.10
N$25
  Top 0.254: IC3.14 18.63,29.5 19.05,29.08 19.05,24.38 U$5.11
N$26
  Top 0.254: U$8.3 74.3,14.61 80.01,14.61 80.64,15.24 80.64,17.14 82.55,19.05 82.55,20.95 84.45,22.86 84.45,27.94 80.94,31.45 IC7.6
N$27  (via drill 0.6)
  Top 0.254: IC4.2 122.28,28.86 122.56,28.57 122.56,22.23 121.28,20.95 121.28,19.68 120.02,18.41 v116.2,18.41
  Bottom 0.254: v116.2,18.41 114.94,17.14 114.94,15.24 113.03,13.34 U$9.1
N$28
  Top 0.254: U$9.2 114.94,17.14 119.51,17.14 121.92,19.56 121.92,20.83 123.19,22.1 123.19,28.74 122.43,29.5 IC4.3
N$29
  Top 0.254: U$9.3 116.2,14.61 121.92,14.61 123.19,15.88 123.19,20.45 124.46,21.72 124.46,29.34 122.34,31.45 IC4.6
N$30
  Top 0.254: IC4.5 122.23,30.8 123.7,29.34 123.7,21.84 122.56,20.7 122.56,19.43 119,15.88 U$9.6
N$31  (via drill 0.6)
  Top 0.254: IC4.13 116.66,30.16 118.75,28.07 v118.75,24.13
  Bottom 0.254: v118.75,24.13 117.47,22.86 117.47,21.59 115.82,19.93 U$9.14
N$32
  Top 0.254: IC4.11 116.5,31.45 116.84,31.11 116.84,30.73 120.02,27.56 U$9.10
N$33
  Top 0.254: IC4.14 116.55,29.5 117.86,28.19 117.86,23.36 U$9.11
N$34
  Top 0.254: IC4.10 116.61,32.1 117.47,31.24 117.47,30.86 121.28,27.05 U$9.9
N$35
  Top 0.254: U$6.1 98.42,16.51 100.33,18.41 106.05,18.41 107.31,19.68 107.31,20.95 108.58,22.23 108.58,22.86 107.95,23.5 107.95,27.3 108.58,27.94 108.58,28.57 108.31,28.86 IC5.2
N$36  (via drill 0.6)
  Top 0.254: U$6.2 101.6,17.78 106.68,17.78 107.95,19.05 107.95,20.32 v109.86,22.23 | IC5.3 108.92,29.5 109.22,29.21 v109.22,26.67
  Bottom 0.254: v109.86,22.23 109.22,22.23 107.95,23.5 107.95,25.4 v109.22,26.67
N$37
  Top 0.254: U$6.3 102.23,14.61 107.95,14.61 108.58,15.24 108.58,17.14 110.49,19.05 110.49,21.59 111.76,22.86 111.76,28.57 108.88,31.45 IC5.6
N$38  (via drill 0.6)
  Top 0.254: U$6.6 105.41,15.88 106.68,17.14 107.31,17.14 109.22,19.05 v109.22,20.32 | IC5.5 108.64,30.8 110.74,28.7 v110.74,26.42
  Bottom 0.254: v109.22,20.32 111.76,22.86 111.76,25.4 v110.74,26.42
N$39
  Top 0.254: IC5.10 102.52,32.1 103.5,31.11 103.5,30.86 107.31,27.05 U$6.9
N$40
  Top 0.254: U$6.10 106.05,27.56 102.87,30.73 102.87,30.99 102.4,31.45 IC5.11
N$41
  Top 0.254: U$6.11 104.14,22.48 102.87,23.75 102.87,29.21 102.58,29.5 IC5.14
N$42  (via drill 0.6)
  Top 0.254: v104.14,24.13 104.14,28.7 102.69,30.16 IC5.13
  Bottom 0.254: v104.14,24.13 103.5,23.5 103.5,21.59 101.85,19.93 U$6.14
N$43
  Top 0.254: U$7.1 84.45,16.51 86.36,18.41 92.08,18.41 94.61,20.95 94.61,28.57 94.33,28.86 IC6.2
N$44
  Top 0.254: U$7.2 87.63,17.78 92.71,17.78 95.25,20.32 95.25,28.7 94.45,29.5 IC6.3
N$45
  Top 0.254: 93.64,31.45 IC6.6 94.91,31.45 96.52,29.84 96.52,19.05 94.61,17.14 94.61,15.24 93.98,14.61 88.27,14.61 U$7.3
N$46  (via drill 0.6)
  Top 0.254: v81.28,20.32 81.28,19.05 79.38,17.14 78.74,17.14 77.47,15.88 U$8.6 | IC7.5 80.7,30.8 81.92,29.59 81.92,28.57 v83.19,27.3
  Bottom 0.254: v83.19,27.3 83.19,26.04 83.82,25.4 83.82,23.5 81.28,20.95 v81.28,20.32
N$47
  Top 0.254: IC6.10 88.9,32.1 89.53,31.47 89.53,30.99 93.34,27.18 U$7.9
N$48
  Top 0.254: IC6.11 88.56,31.45 88.9,31.11 88.9,30.73 92.08,27.56 U$7.10
N$49
  Top 0.254: IC6.14 88.61,29.5 89.53,28.57 89.53,23.75 U$7.11
N$50  (via drill 0.6)
  Top 0.254: IC6.13 88.72,30.16 90.81,28.07 v90.81,24.13
  Bottom 0.254: v90.81,24.13 89.53,22.86 89.53,21.59 87.88,19.93 U$7.14
N$51
  Top 0.254: U$8.1 70.48,16.51 72.39,18.41 78.11,18.41 79.38,19.68 79.38,20.95 80.64,22.23 80.64,22.86 80.01,23.5 80.01,27.3 80.64,27.94 80.64,28.57 80.36,28.86 IC7.2
N$52
  Top 0.254: U$8.2 73.66,17.78 78.74,17.78 80.01,19.05 80.01,20.32 81.92,22.23 82.55,22.23 83.82,23.5 83.82,25.4 81.28,27.94 81.28,29.21 80.98,29.5 IC7.3
N$53
  Top 0.254: IC7.10 74.7,32.1 75.56,31.24 75.56,30.73 79.38,26.92 U$8.9
N$54
  Top 0.254: IC7.14 74.51,29.5 74.93,29.08 74.93,24.38 U$8.11
N$55  (via drill 0.6)
  Top 0.254: IC7.13 74.62,30.16 76.2,28.57 v76.2,24.77
  Bottom 0.254: v76.2,24.77 75.56,24.13 75.56,21.59 73.91,19.93 U$8.14
N$56
  Top 0.254: IC7.11 74.59,31.45 74.93,31.11 74.93,30.61 78.11,27.43 U$8.10
N$58
  Top 0.254: U$10.3 60.33,14.61 66.04,14.61 66.67,15.24 66.67,17.14 68.58,19.05 68.58,29.84 66.97,31.45 IC8.6
N$59
  Top 0.254: U$10.1 56.52,16.51 58.42,18.41 64.14,18.41 66.67,20.95 66.67,28.57 66.39,28.86 IC8.2
N$60
  Top 0.254: U$10.2 59.69,17.78 64.77,17.78 67.31,20.32 67.31,28.7 66.51,29.5 IC8.3
N$61
  Top 0.254: U$10.6 63.5,15.88 64.77,17.14 65.41,17.14 67.94,19.68 67.94,29.21 66.35,30.8 IC8.5
N$62
  Top 0.254: IC8.14 60.54,29.5 60.96,29.08 60.96,24.38 U$10.11
N$63
  Top 0.254: IC8.10 60.73,32.1 61.59,31.24 61.59,30.73 65.41,26.92 U$10.9
N$64
  Top 0.254: IC8.11 60.62,31.45 60.96,31.11 60.96,30.61 64.14,27.43 U$10.10
N$65  (via drill 0.6)
  Top 0.254: IC8.13 60.65,30.16 62.23,28.57 v62.23,24.77
  Bottom 0.254: v62.23,24.77 61.59,24.13 61.59,21.59 59.94,19.93 U$10.14
S0  (via drill 0.6)
  Top 0.254: IC1.1 50.92,28.2 48.26,30.86 v48.26,33.02 48.26,33.66 48.26,46.99 52.7,51.44 102.87,51.44 111.25,59.82 111.25,90.17 112.39,91.31 U$1.8
  Bottom 0.254: JP2.1 49.53,33.02 v48.26,33.02
S1
  Top 0.254: IC1.7 50.45,32.1 49.53,33.02 JP2.2 49.53,46.99 53.34,50.8 103.5,50.8 112.39,59.69 U$1.7
S2
  Top 0.254: IC1.9 45.98,34.55 JP2.3 46.99,46.99 52.07,52.07 102.23,52.07 109.86,59.69 U$1.9
S3
  Top 0.254: IC1.15 45.44,28.86 43.18,31.11 43.18,31.75 44.45,33.02 JP2.4 44.45,45.72 51.44,52.7 101.6,52.7 108.58,59.69 108.58,90.17 U$1.10
S4  (via drill 0.6)
  Top 0.254: IC2.1 37.2,28.2 34.29,31.11 v34.29,33.02 34.29,38.1 50.16,53.98 100.33,53.98 106.17,59.82 106.17,90.3 U$1.12
  Bottom 0.254: JP6.1 35.56,33.02 v34.29,33.02
S5
  Top 0.254: U$1.11 107.31,59.69 100.97,53.34 50.8,53.34 35.56,38.1 JP6.2 35.56,33.66 37.11,32.1 IC2.7
S6
  Top 0.254: U$1.13 104.78,59.69 99.69,54.61 49.53,54.61 33.02,38.1 JP6.3 33.02,33.02 32.76,32.76 IC2.9
S7
  Top 0.254: IC2.15 31.47,28.86 29.84,30.48 29.84,31.75 30.48,32.38 JP6.4 30.48,36.83 48.9,55.24 99.06,55.24 103.5,59.69 103.5,90.17 U$1.14
S8  (via drill 0.6)
  Top 0.254: IC3.1 22.98,28.2 20.32,30.86 v20.32,32.51 20.32,36.83 40.01,56.52 97.79,56.52 100.84,59.56 100.84,90.04 U$1.16
  Bottom 0.254: JP7.1 21.08,32.51 v20.32,32.51
S9
  Top 0.254: IC3.7 23.14,32.1 21.59,33.66 JP7.2 21.59,36.83 40.64,55.88 98.42,55.88 102.23,59.69 U$1.15
S10
  Top 0.254: IC3.9 18.79,32.76 19.05,33.02 JP7.3 19.05,36.83 39.37,57.15 97.16,57.15 99.69,59.69 U$1.17
S11
  Top 0.254: IC3.15 17.5,28.86 15.88,30.48 15.88,31.75 16.51,32.38 JP7.4 38.73,57.78 96.52,57.78 98.42,59.69 98.42,90.17 U$1.18
S12  (via drill 0.6)
  Top 0.254: IC4.1 121.02,28.2 118.75,30.48 v118.75,33.66 | U$1.26 90.81,92.71 113.03,92.71 113.67,92.08 113.67,54.61 v118.75,49.53 | v118.75,45.72 118.75,38.73 JP8.1
  Bottom 0.254: v118.75,33.66 120.02,33.66 JP8.1 | v118.75,49.53 v118.75,45.72
S13
  Top 0.254: U$1.57 109.22,38.73 116.2,38.73 JP8.2 120.14,34.8 120.14,32.51 120.55,32.1 IC4.7
S14
  Top 0.254: IC4.9 115.83,33.4 116.84,34.41 JP8.3 114.3,38.1 107.31,38.1 106.05,39.37 106.05,41.91 U$1.58
S15
  Top 0.254: U$1.59 104.78,39.37 106.68,37.47 112.39,37.47 JP8.4 114.3,32.38 113.67,31.75 113.67,30.48 114.3,29.84 114.3,29.21 114.66,28.86 IC4.15
S16
  Top 0.254: U$1.60 103.5,41.91 103.5,40.01 104.14,39.37 104.14,37.47 | IC5.1 106.92,28.2 104.14,30.99 104.14,37.47 | JP9.1 106.68,36.83 106.05,36.83 105.41,37.47 104.14,37.47
S17  (via drill 0.6)
  Top 0.254: IC5.7 106.96,32.1 105.41,33.66 JP9.2 | U$1.61 102.23,37.97 v102.62,37.59
  Bottom 0.254: v102.62,37.59 103.38,37.59 JP9.2
S18
  Top 0.254: U$1.62 100.97,41.91 100.97,37.47 JP9.3 102.87,33.77 IC5.9
S19
  Top 0.254: IC5.15 101.32,28.86 99.69,30.48 99.69,31.75 100.33,32.38 JP9.4 99.69,36.2 U$1.63
S20  (via drill 0.6)
  Top 0.254: IC6.1 93.08,28.2 90.17,31.11 v90.17,33.66 | U$1.64 98.42,41.91 98.42,40.01 JP10.1
  Bottom 0.254: JP10.1 92.08,33.66 v90.17,33.66
S21  (via drill 0.6)
  Top 0.254: IC6.7 92.36,32.1 91.44,33.02 JP10.2 91.44,36.58 92.33,37.47 94.61,37.47 95.89,38.73 v95.89,45.72 | U$1.28 88.27,90.17 90.17,90.17 90.81,89.53 90.81,88.27 91.44,87.63 94.61,87.63 95.89,86.36 v95.89,59.69
  Bottom 0.254: v95.89,59.69 v95.89,45.72
S22  (via drill 0.6)
  Top 0.254: IC6.9 87.89,34.55 JP10.3 91.44,38.1 92.71,38.1 93.34,38.73 93.34,43.81 94.61,45.09 v94.61,45.72 | U$1.27 87,88.27 88.27,87 93.34,87 94.61,85.72 v94.61,59.69
  Bottom 0.254: v94.61,59.69 v94.61,45.72
S23
  Top 0.254: IC6.15 87.35,28.86 85.72,30.48 85.72,31.75 86.36,32.38 JP10.4
  Bottom 0.254: U$1.67 93.98,40.64 90.81,37.47 88.27,37.47 JP10.4
S24  (via drill 0.6)
  Top 0.254: IC7.1 78.86,28.2 76.45,30.61 76.45,32.64 v77.47,33.66 | JP11.1 83.19,35.56 v83.82,36.2
  Bottom 0.254: U$1.68 93.34,41.91 91.44,41.91 90.81,41.27 90.81,38.86 90.04,38.1 85.72,38.1 v83.82,36.2 | v77.47,33.66 78.11,33.66 JP11.1
S25
  Top 0.254: IC7.7 79.02,32.1 78.74,32.38 78.74,34.29 JP11.2 79.25,37.34 88.14,37.34 91.44,40.64 U$1.69
S26  (via drill 0.6)
  Top 0.254: U$1.70 90.81,41.91 88.9,41.91 88.27,41.27 88.27,40.01 86.61,38.35 76.45,38.35 74.93,36.83 JP11.3 | IC7.9 75.19,32.76 v75.56,32.38
  Bottom 0.254: JP11.3 75.56,34.92 v75.56,32.38
S27
  Top 0.254: U$1.71 89.53,40.01 87.38,37.85 77.72,37.85 76.2,36.32 76.2,34.54 75.44,33.78 72.39,33.78 | IC7.15 73.38,28.86 71.75,30.48 71.75,31.75 72.39,32.38 72.39,33.78 | 72.39,33.78 JP11.4
S28
  Top 0.254: IC8.1 65.14,28.2 62.87,30.48 62.87,32.38 JP12.1 68.58,35.56 73.03,40.01 73.03,41.91 87.63,41.91 88.9,43.18 U$1.72
S29  (via drill 0.6)
  Top 0.254: U$1.73 86.23,40.64 84.96,39.37 73.66,39.37 66.39,32.1 IC8.7 64.42,32.1 v64.14,32.38
  Bottom 0.254: v64.14,32.38 63.5,33.02 JP12.2
S30
  Top 0.254: U$1.76 83.19,44.45 71.12,44.45 70.48,43.81 70.48,40.26 67.56,37.34 62.74,37.34 JP12.3 59.95,34.55 IC8.9
S31
  Top 0.254: IC8.15 59.41,28.86 57.78,30.48 57.78,31.75 58.42,32.38 JP12.4 58.42,36.2 60.33,38.1 66.67,38.1 U$1.87
VDD_3V3EXP
  Top 0.254: U$1.50 U$1.49

### Text on the board
tNames: LEDscape Transmitter | Rev B 2014-08-01 | - - | By Matt Mets / and Trammell Hudson | + - | - + | LEDscape